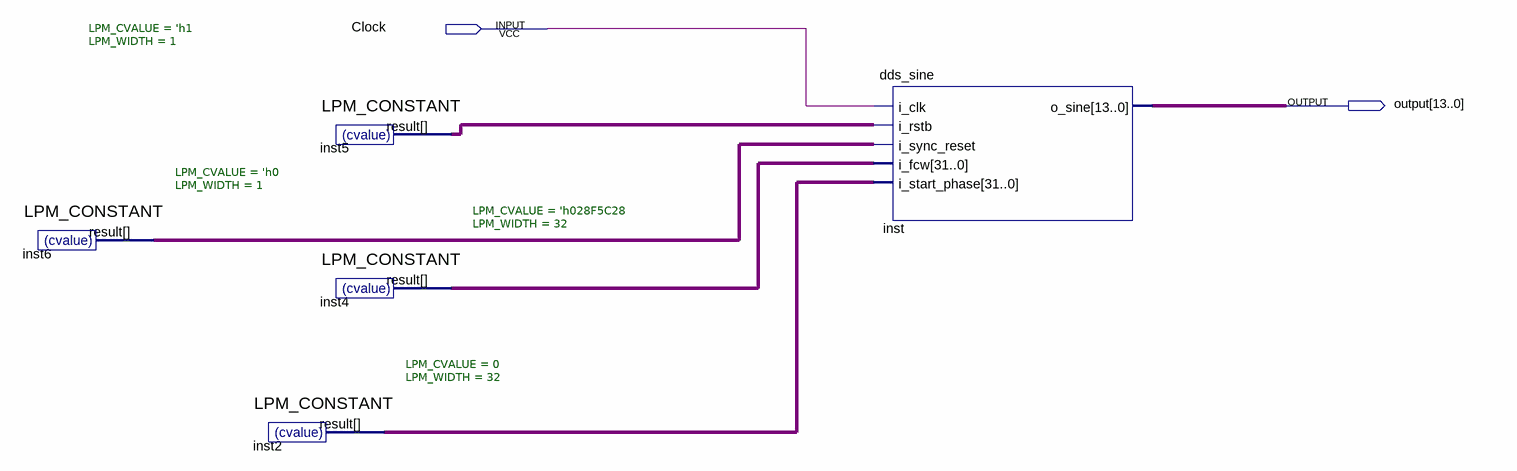
[diagram p0: schematic sheet]
// Quartus schematic DDS_TEST.bdf as structural Verilog: 5 symbols, 2 pins
module DDS_TEST (
  input  Clock,
  output [13:0] \output 
);

  wire inst5_result, inst6_result;
  wire [31:0] inst2_result, inst4_result;

  LPM_CONSTANT #(.LPM_CVALUE('h0), .LPM_WIDTH(1)) inst6 (.result(inst6_result));
  LPM_CONSTANT #(.LPM_CVALUE(0), .LPM_WIDTH(32)) inst2 (.result(inst2_result));
  LPM_CONSTANT #(.LPM_CVALUE('h1), .LPM_WIDTH(1)) inst5 (.result(inst5_result));
  LPM_CONSTANT #(.LPM_CVALUE('h028F5C28), .LPM_WIDTH(32)) inst4 (.result(inst4_result));
  dds_sine inst (
    .i_clk(Clock), .i_rstb(inst5_result), .i_sync_reset(inst6_result), .i_fcw(inst4_result),
    .i_start_phase(inst2_result), .o_sine(\output ));
endmodule
